# EAGLE design tritiled22_5630 (EAGLE 8.2.2)
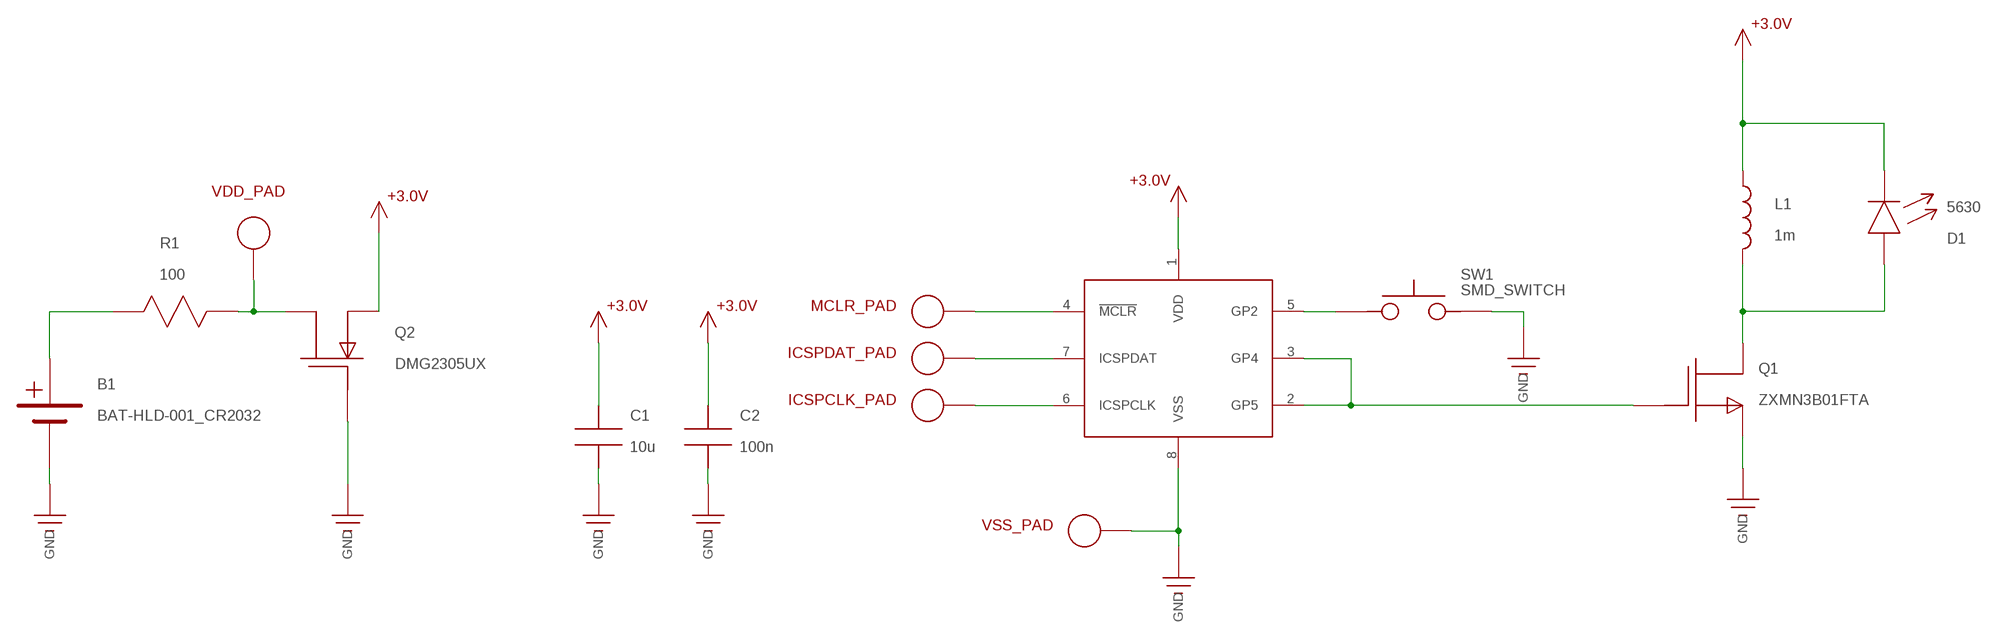
[diagram p0: schematic, sheet 1]

## Parts
B1  BAT-HLD-001_CR2032  [CR2032_BAT-HLD_001]
C1  10u  C1206  [1206]
C2  100n  C0805  [0805]
D1  5630  LED5630  [LED_5630]
ICSPCLK_PAD  ICSP_PAD  [ICSP_PAD]
ICSPDAT_PAD  ICSP_PAD  [ICSP_PAD]
L1  1m  SRR6028_INDUCTOR  [SRR6028_INDUCTOR]
MCLR_PAD  ICSP_PAD  [ICSP_PAD]
Q1  ZXMN3B01FTA  ZXMN3B01FSOT23  [SOT-23]
Q2  DMG2305UX  DMG2305UXSOT23  [SOT-23]
R1  100  R1206  [R1206]
SW1  SMD_SWITCH  [SMD_SWITCH]
U1  PIC12LF1571  [SOIC8]
VDD_PAD  ICSP_PAD  [ICSP_PAD]
VSS_PAD  ICSP_PAD  [ICSP_PAD]

## Nets
+3.3V: C1.P$1 C2.P$1 D1.C@1(C) D1.C@2(C) L1.P$1 Q2.2(S) U1.1(VDD) ; supply symbol labelled +3.0V
GND: B1.GND(0V) C1.P$2 C2.P$2 Q1.2(S) Q2.1(G) SW1.P$3 SW1.P$4 U1.8(VSS) VSS_PAD.P$2
N$1: MCLR_PAD.P$2 U1.4(!MCLR!)
N$2: ICSPDAT_PAD.P$2 U1.7(ICSPDAT)
N$4: ICSPCLK_PAD.P$2 U1.6(ICSPCLK)
N$5: D1.A@1(A) D1.A@2(A) L1.P$2 Q1.3(D)
N$6: SW1.P$1 SW1.P$2 U1.5(GP2)
N$8: Q1.1(G) U1.2(GP5) U1.3(GP4)
VBATT: B1.+V1(+V) B1.+V2(+V) R1.P$1
VSAFE: Q2.3(D) R1.P$2 VDD_PAD.P$2

## Library data of the parts
B1 = tritiled:BAT-HLD-001_CR2032
C1 C2 = tritiled:C
D1 = tritiled:LED
ICSPCLK_PAD ICSPDAT_PAD MCLR_PAD VDD_PAD VSS_PAD = led_temp:ICSP_PAD
L1 = tritiled:SRR6028_INDUCTOR
Q1 = tritiled:ZXMN3B01F
Q2 = tritiled:DMG2305UX
R1 = tritiled:R
SW1 = tritiled:SMD_SWITCH
U1 = tritiled:PIC12LF1571

## Board
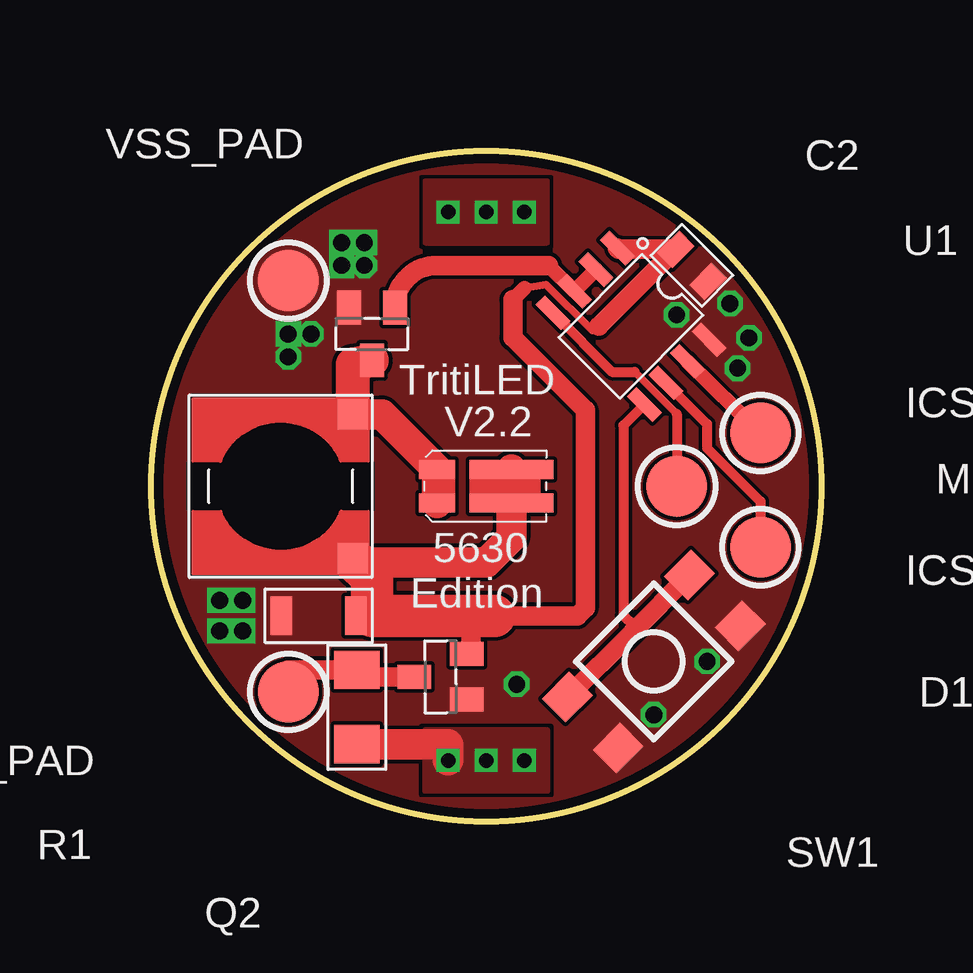
[diagram p1: board, top side]
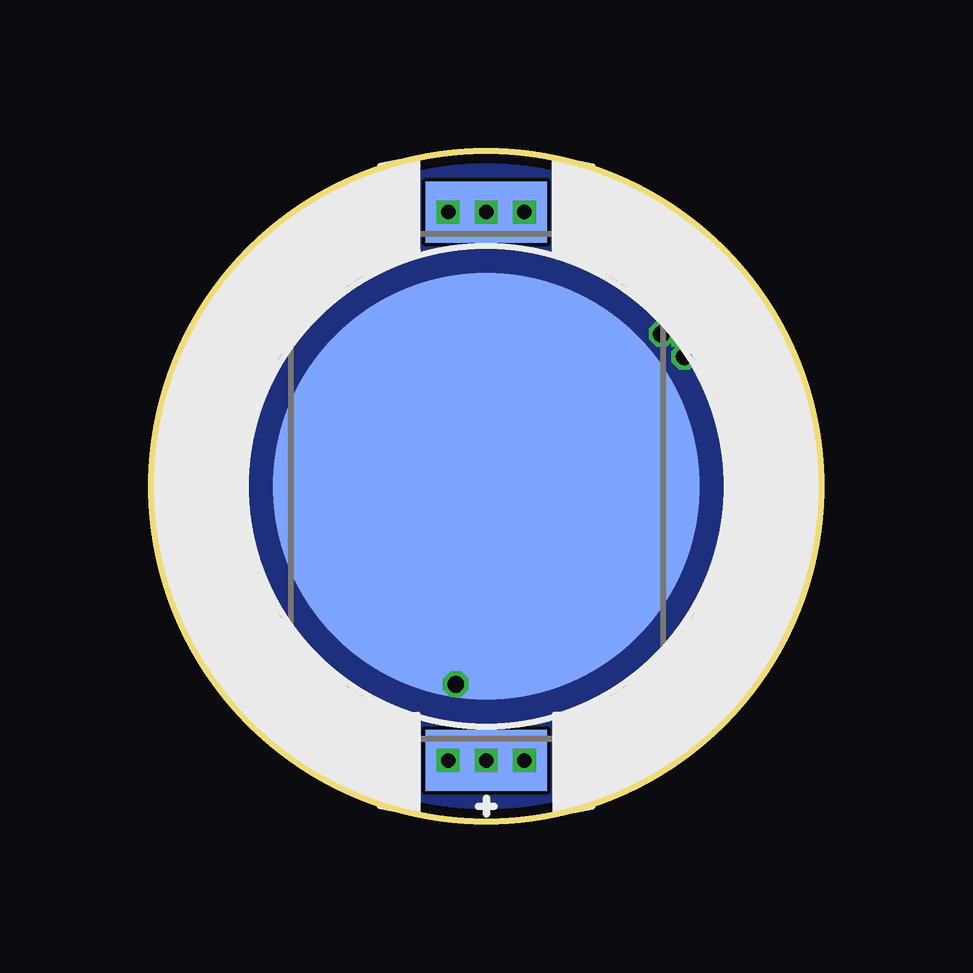
[diagram p2: board, bottom side, seen from below]

Size 27.94 x 27.94 mm. Coordinates in mm from the lower left corner, seen from the top.
Outline: circle at 13.97,13.97 radius 13.97
Copper layers (1*16): Top 0.0356mm / dielectric 1.5011mm / Bottom 0.0356mm
Design rules "LaenPCBOrder_tented_vias": minimum track width 6mil, minimum drill 13mil, track to track 6mil, track to pad 6mil, pad to pad 6mil, via to via 6mil, smd to smd 6mil, copper to edge 15mil, drill to drill 6mil, minimum pad ring 7mil, minimum via ring 7mil, stop-mask expansion 3mil, vias tented up to drill 16mil, thermal gap 10mil

### Footprints (pad centres in the part's own frame; a part is rotated, then mirrored left to right if it is on the bottom)
CR2032_BAT-HLD_001 = smd 2.54 x 5.08: +V1 -11.43,0; +V2 11.43,0 | smd 17.78 x 17.78: GND 0,0
1206 = smd 0.9 x 1.6: P$1 -1.55,0; P$2 1.55,0
0805 = smd 0.9 x 1.3: P$1 -0.95,0; P$2 0.95,0
LED_5630 = smd 1.5 x 0.8: A@1 2.05,0.7; A@2 2.05,-0.7 | smd 3.5 x 0.8: C@1 -1.05,0.7; C@2 -1.05,-0.7
ICSP_PAD = smd 2.54 x 2.54: P$2 0,0
SRR6028_INDUCTOR = smd 1.27 x 1.27: P$1 -3,3; P$2 -3,-3
SOT-23 = smd 1 x 1.4: 1 -0.95,-1.1; 2 0.95,-1.1; 3 0,1.1
R1206 = smd 1.6 x 1.9: P$1 -1.55,0; P$2 1.55,0
SMD_SWITCH = smd 1.6 x 1.4: P$1 -3.6,1.5; P$2 3.6,1.5; P$3 3.6,-1.5; P$4 -3.6,-1.5
SOIC8 = smd 0.55 x 1.5: 1 -1.905,-2.7; 2 -0.635,-2.7; 3 0.635,-2.7; 4 1.905,-2.7; 5 1.905,2.7; 6 0.635,2.7; 7 -0.635,2.7; 8 -1.905,2.7

### Placement (x,y rotation side)
B1  13.97,13.97 270 bottom
C1  6.99,8.57 180 top
C2  22.54,23.18 315 top
D1  13.97,13.97 180 top
ICSPCLK_PAD  25.4,11.43 90 top
ICSPDAT_PAD  25.4,16.19 0 top
L1  5.4,13.97 180 top
MCLR_PAD  21.91,13.97 0 top
Q1  9.21,20.32 180 top
Q2  12.07,6.03 90 top
R1  8.57,4.76 90 top
SW1  20.96,6.67 45 top
U1  20,20.64 225 top
VDD_PAD  5.72,5.4 90 top
VSS_PAD  5.72,22.54 0 top

### Tracks (layer width: path | path; a pad name or v marks a point on that pad's centre or on a via)
+3.3V
  Top 0.254: 8.86,11.43 L1.P$1
  Top 0.305: 18.66,20.64 18.39,20.45 16.47,22.38 15.56,22.23
  Top 0.61: C2.P$1 21.87,23.89 | 15.56,22.23 15.08,21.75 | C1.P$1 9.21,8.57
  Top 0.813: 18.66,20.64 C2.P$1 19.48,23.85 U1.1 | Q2.2 13.34,6.98 13.34,8.57 | 14.32,8.57 17.78,8.57 18.1,8.89 18.1,17.15 15.08,20.16 15.08,21.75
  Top 1.27: D1.C@2 D1.C@1 15.02,11.85 13.97,10.79 8.57,10.79 L1.P$1
  Top 1.778: 8.49,10.88 L1.P$1 9.21,10.16 9.21,8.57 13.34,8.57 14.32,8.57
GND  (via drill 0.7)
  other vias: 3.81,9.21 3.81,7.94 2.86,9.21 2.86,7.94 7.94,24.13 7.94,23.18 6.67,20.32 5.72,20.32 5.72,19.37 24.13,21.59 21.91,21.11 24.92,20.16 8.89,24.13 8.89,23.18 20.96,4.45 23.18,6.67 24.45,18.89 15.24,5.71
  pour Bottom (no thermals): -1.27,-0.63 28.57,-0.63 28.57,28.58 -1.27,28.58
  pour Top (rank 2, no thermals): -1.27,-0.63 28.57,-0.63 28.57,28.58 -1.27,28.58
N$1
  Top 0.305: 20.16,18.73 21.91,16.99
  Top 0.406: U1.4 19.21,18.73 20.16,18.73 | 21.91,16.99 MCLR_PAD.P$2
N$2
  Top 0.61: U1.7 ICSPDAT_PAD.P$2
N$4
  Top 0.406: U1.6 23.18,16.56 23.18,15.56 25.4,13.34 ICSPCLK_PAD.P$2
N$5
  Top 1.27: L1.P$2 9.62,16.97 D1.A@2 D1.A@1
  Top 1.422: Q1.3 8.4,19.05 L1.P$2
N$6
  Top 0.406: U1.5 19.68,16.5 19.68,8.57 20.05,8.2 20.05,7.89
  Top 0.813: SW1.P$1 20.05,7.89 SW1.P$2
N$8
  Top 0.61: U1.2 U1.3 16.56,23.18
  Top 0.813: 16.56,23.18 11.92,23.18 arc90 Q1.1
VBATT  (via drill 0.6)
  Top 1.27: R1.P$1 12.38,3.21 v12.38,2.54
  other vias: 13.97,25.4 12.38,25.4 15.56,25.4 13.97,2.54 15.56,2.54
  pour Top: 11.43,1.27 11.43,3.81 16.51,3.81 16.51,1.27
  pour Top (no thermals): 11.43,26.67 11.43,24.13 16.51,24.13 16.51,26.67
VSAFE
  Top 0.813: VDD_PAD.P$2 5.72,6.31 R1.P$2 8.57,6.03 Q2.3

### Text on the board
tPlace: TritiLED | V2.2 | 5630 | Edition